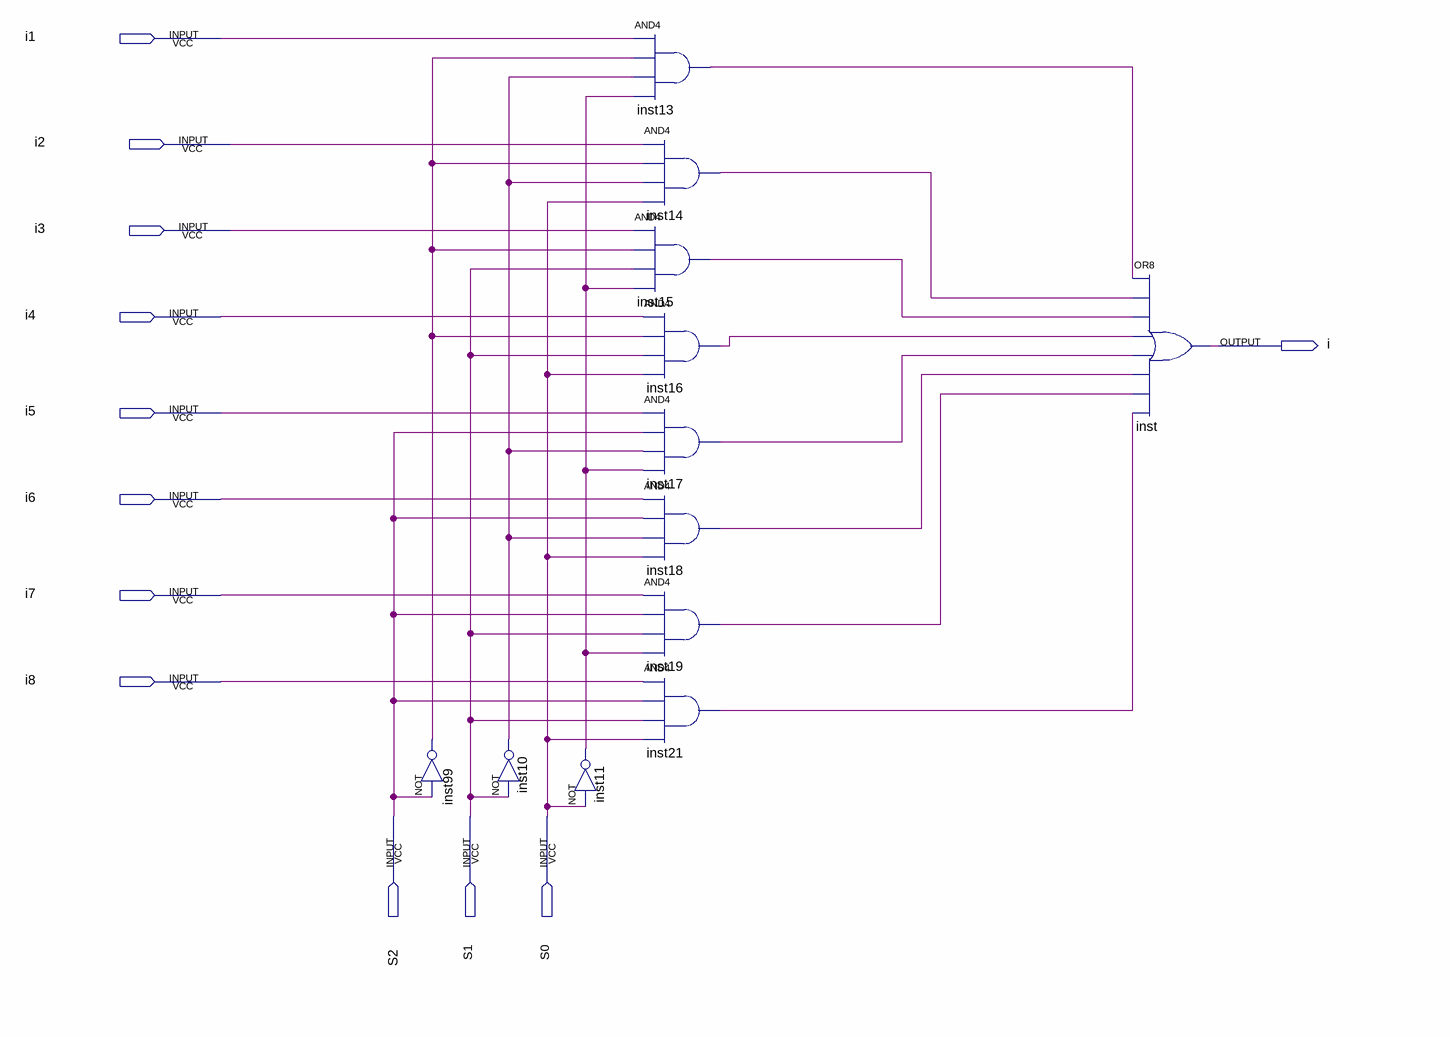
[diagram p0: schematic sheet]
// Quartus schematic Mux.bdf as structural Verilog: 12 symbols, 12 pins
module Mux (
  input  i1,
  input  i2,
  input  i3,
  input  i4,
  input  i5,
  input  i6,
  input  i7,
  input  i8,
  input  S2,
  input  S1,
  input  S0,
  output i
);

  wire inst10_out, inst11_out, inst13_out, inst14_out, inst15_out, inst16_out, inst17_out, inst18_out,
       inst19_out, inst21_out, inst99_out;

  not inst99 (inst99_out, S2);
  not inst10 (inst10_out, S1);
  not inst11 (inst11_out, S0);
  and inst13 (inst13_out, i1, inst99_out, inst10_out, inst11_out);
  and inst14 (inst14_out, i2, inst99_out, inst10_out, S0);
  and inst15 (inst15_out, i3, inst99_out, S1, inst11_out);
  and inst16 (inst16_out, i4, inst99_out, S1, S0);
  and inst17 (inst17_out, i5, S2, inst10_out, inst11_out);
  and inst18 (inst18_out, i6, S2, inst10_out, S0);
  and inst19 (inst19_out, i7, S2, S1, inst11_out);
  and inst21 (inst21_out, i8, S2, S1, S0);
  or inst (i, inst13_out, inst14_out, inst15_out, inst16_out, inst17_out, inst18_out, inst19_out, inst21_out);
endmodule
